# EAGLE schematic temp-sensor (EAGLE 9.6.2)
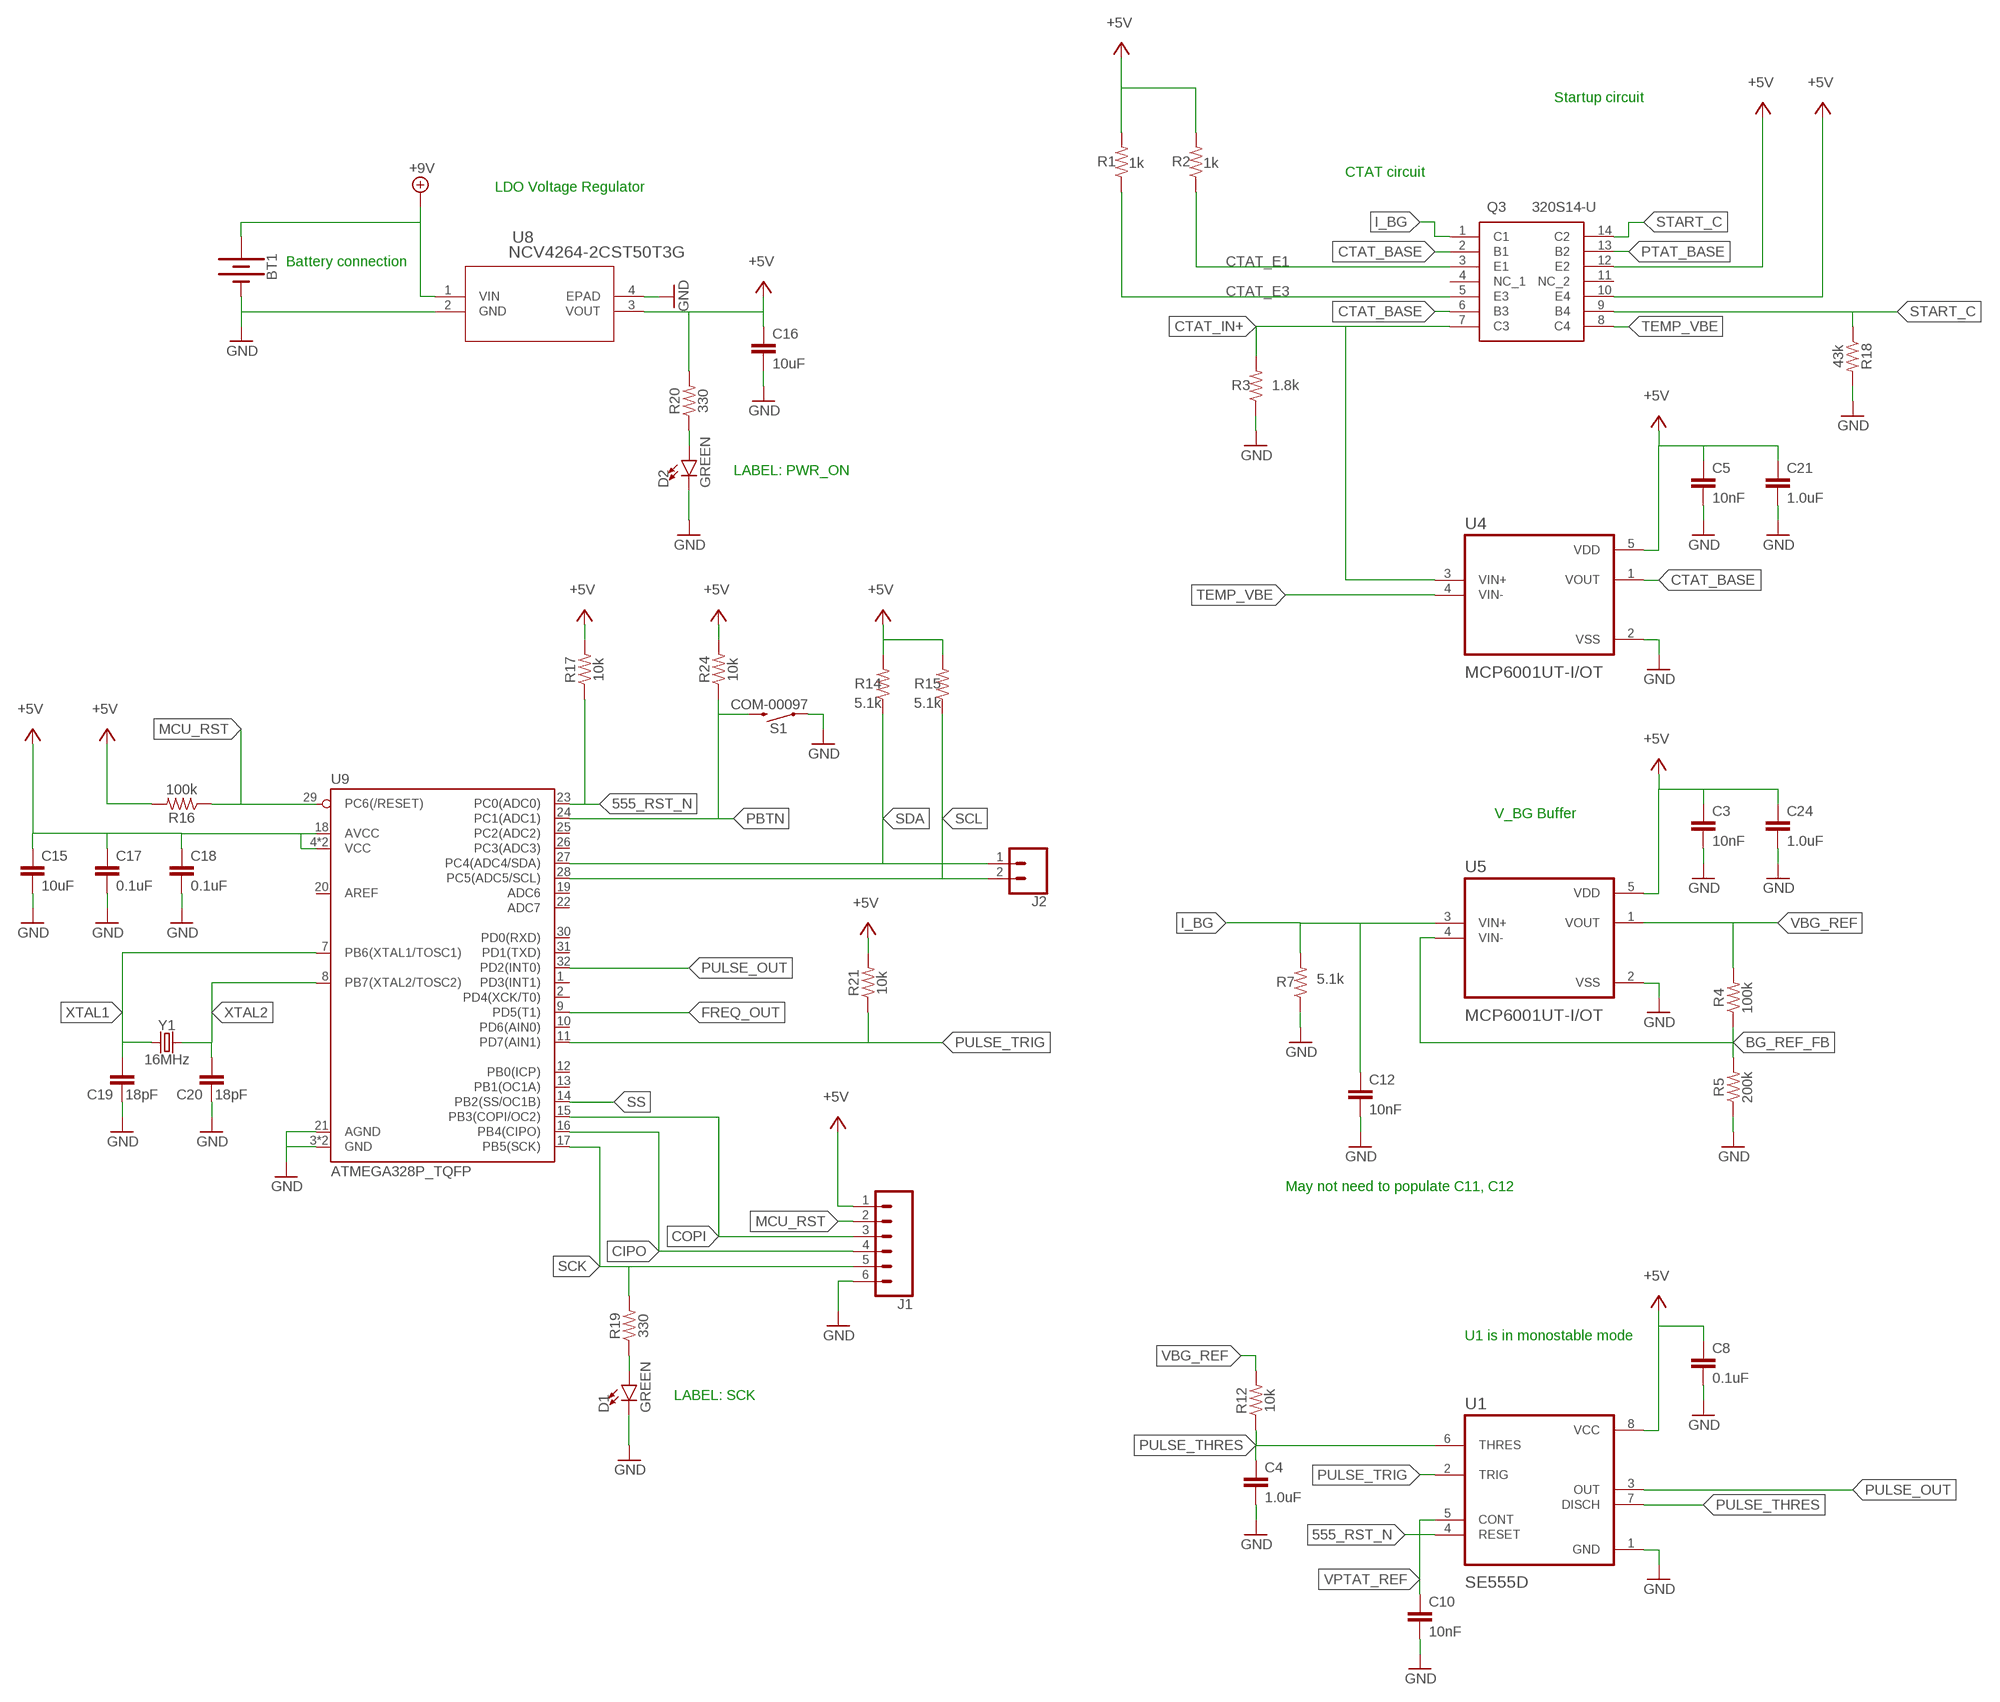
[diagram p0: schematic, sheet 1, part 1 of 2]
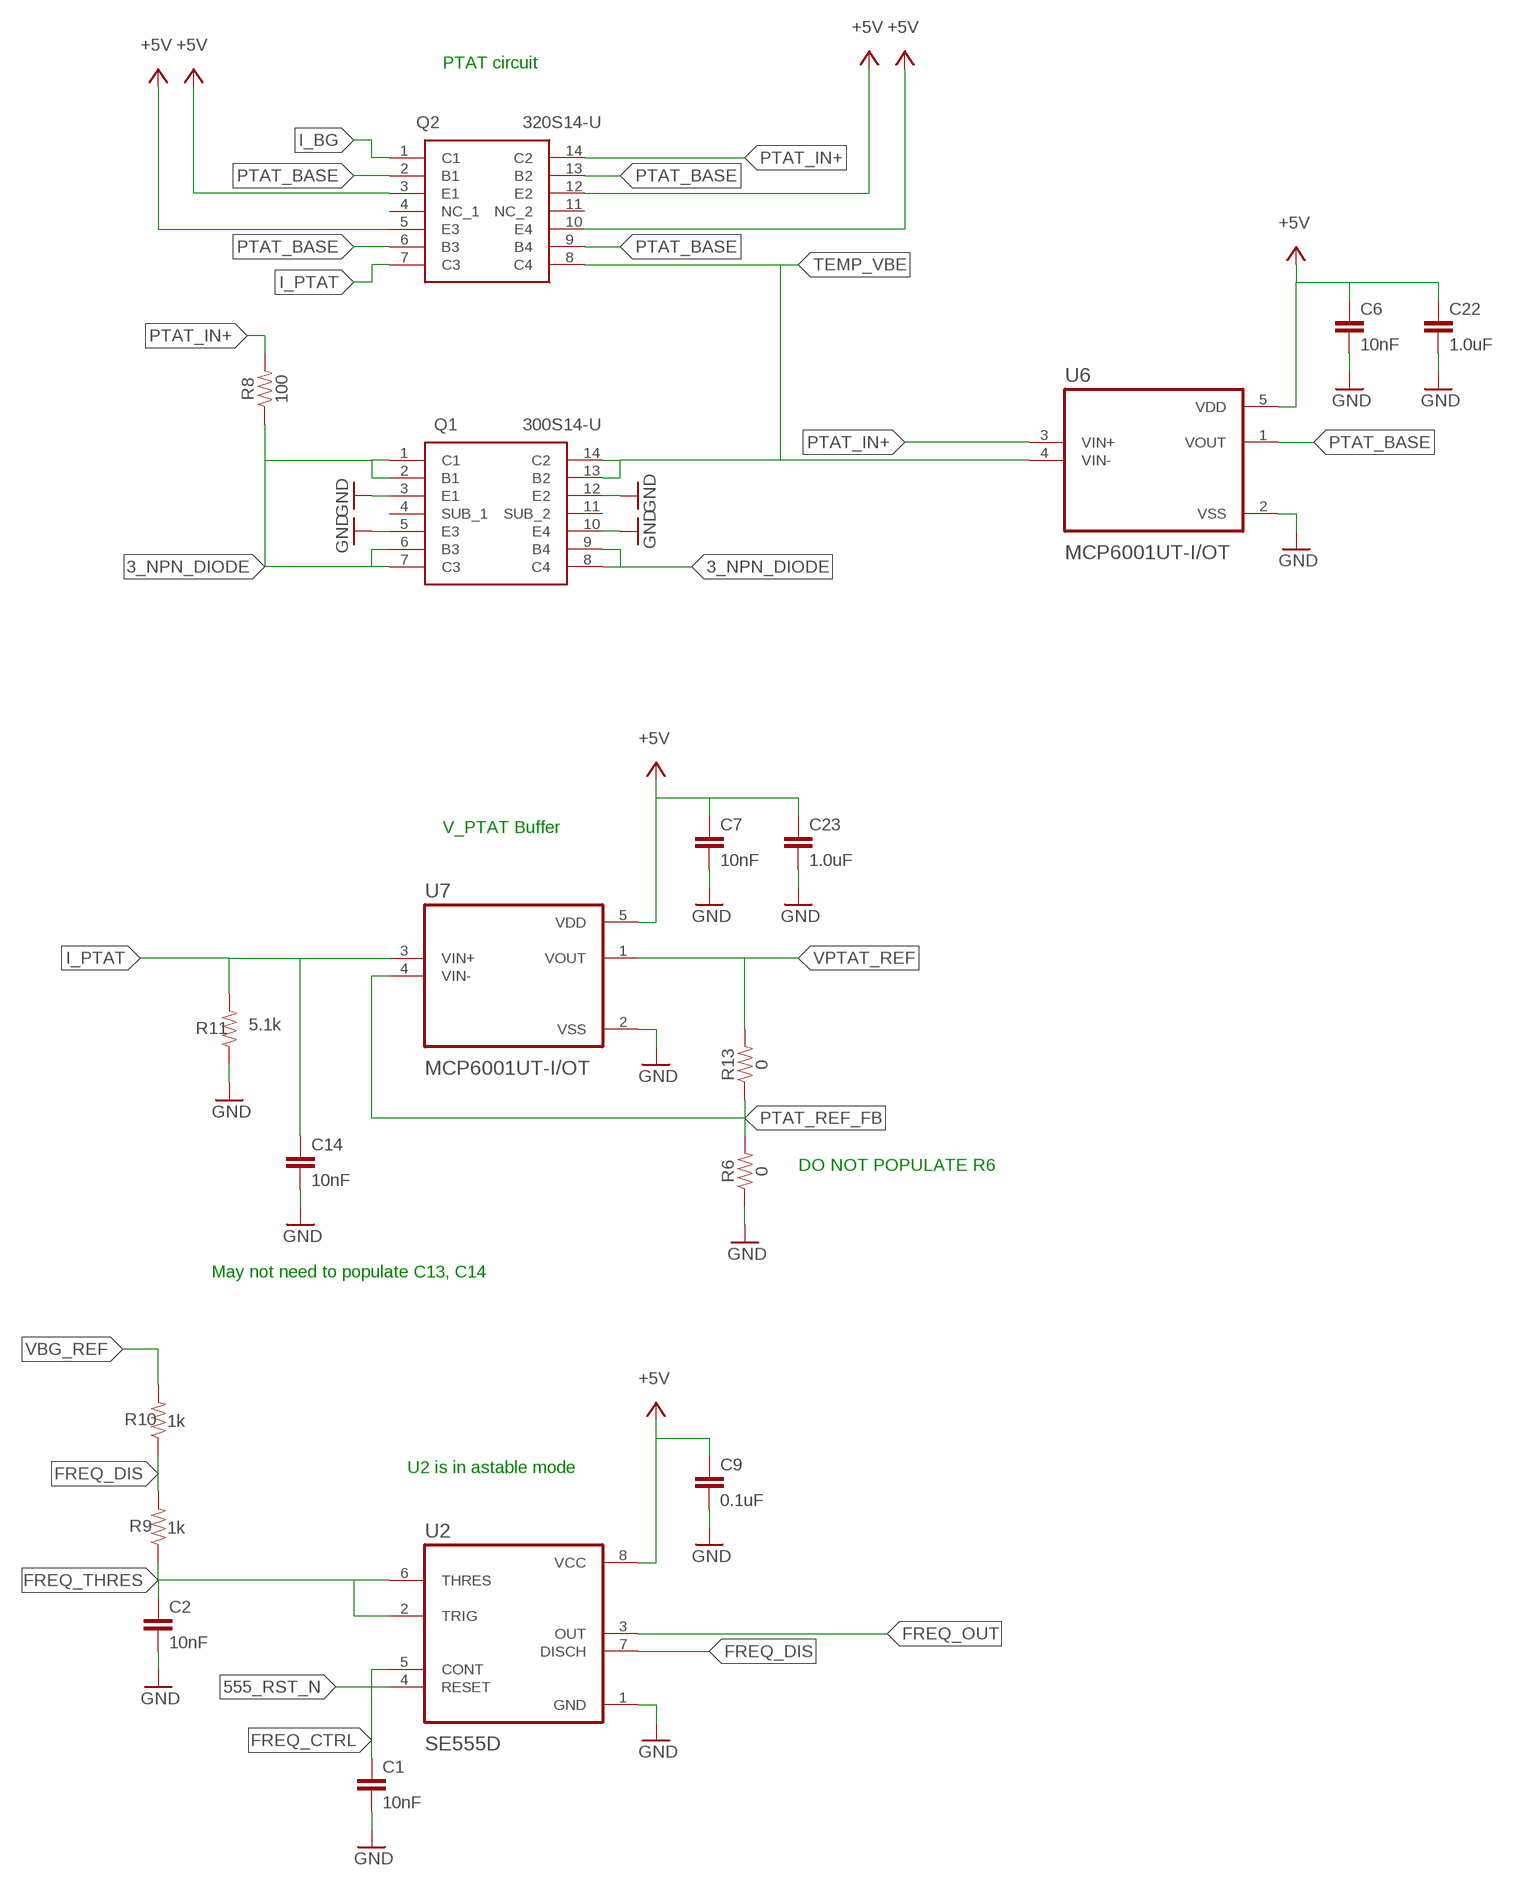
[diagram p1: schematic, sheet 1, part 2 of 2]

## Parts
BT1  BATTERY-9V  [BATTCON_9V]
C1  10nF  10NF-0603-50V-10%  [0603]
C2  10nF  10NF-0603-50V-10%  [0603]
C3  10nF  10NF-0603-50V-10%  [0603]
C4  1.0uF  1.0UF-0603-16V-10%-X7R  [0603]
C5  10nF  10NF-0603-50V-10%  [0603]
C6  10nF  10NF-0603-50V-10%  [0603]
C7  10nF  10NF-0603-50V-10%  [0603]
C8  0.1uF  0.1UF-0603-25V-10%-X7R-WE  [0603]
C9  0.1uF  0.1UF-0603-25V-10%-X7R-WE  [0603]
C10  10nF  10NF-0603-50V-10%  [0603]
C12  10nF  10NF-0603-50V-10%  [0603]
C14  10nF  10NF-0603-50V-10%  [0603]
C15  10uF  10UF-0805-25V-10%  [0805]
C16  10uF  10UF-0805-25V-10%  [0805]
C17  0.1uF  0.1UF-0603-25V-10%-X7R-WE  [0603]
C18  0.1uF  0.1UF-0603-25V-10%-X7R-WE  [0603]
C19  18pF  18PF-0603-50V-5%  [0603]
C20  18pF  18PF-0603-50V-5%  [0603]
C21  1.0uF  1.0UF-0603-16V-10%-X7R  [0603]
C22  1.0uF  1.0UF-0603-16V-10%-X7R  [0603]
C23  1.0uF  1.0UF-0603-16V-10%-X7R  [0603]
C24  1.0uF  1.0UF-0603-16V-10%-X7R  [0603]
D1  GREEN  LED-GREEN1206  [LED-1206]
D2  GREEN  LED-GREEN1206  [LED-1206]
J1  CONN_06SILK_FEMALE_PTH  [1X06]
J2  CONN_02  [1X02]
Q1  300S14-U  [SOIC127P602X175-14N]
Q2  320S14-U  [SOIC127P602X175-14N]
Q3  320S14-U  [SOIC127P602X175-14N]
R1  1k  1KOHM-0603-1/10W-1%  [0603]
R2  1k  1KOHM-0603-1/10W-1%  [0603]
R3  1.8k  1.8KOHM-0603-1/10W-1%  [0603]
R4  100k  100KOHM-0603-1/10W-1%  [0603]
R5  200k  200KOHM-0603-1/10W-1%  [0603]
R6  0  0OHM-0603-1/10W  [0603]
R7  5.1k  5.1KOHM5.1KOHM-0603-1/10W-1%  [0603]
R8  100  100OHM-0603-1/10W-1%  [0603]
R9  1k  1KOHM-0603-1/10W-1%  [0603]
R10  1k  1KOHM-0603-1/10W-1%  [0603]
R11  5.1k  5.1KOHM5.1KOHM-0603-1/10W-1%  [0603]
R12  10k  10KOHM-0603-1/10W-1%  [0603]
R13  0  0OHM-0603-1/10W  [0603]
R14  5.1k  5.1KOHM5.1KOHM-0603-1/10W-1%  [0603]
R15  5.1k  5.1KOHM5.1KOHM-0603-1/10W-1%  [0603]
R16  100k  100KOHM-0603-1/10W-1%  [0603]
R17  10k  10KOHM-0603-1/10W-1%  [0603]
R18  43k  43KOHM-0603-1/10W-1%  [0603]
R19  330  330OHM-0603-1/10W-1%  [0603]
R20  330  330OHM-0603-1/10W-1%  [0603]
R21  10k  10KOHM-0603-1/10W-1%  [0603]
R24  10k  10KOHM-0603-1/10W-1%  [0603]
S1  MOMENTARY-SWITCH-SPST-PTH-6.0MM  [TACTILE_SWITCH_PTH_6.0MM]
U1  SE555D  [SOIC127P599X175-8N]
U2  SE555D  [SOIC127P599X175-8N]
U4  MCP6001UT-I/OT  [SOT95P270X145-5N]
U5  MCP6001UT-I/OT  [SOT95P270X145-5N]
U6  MCP6001UT-I/OT  [SOT95P270X145-5N]
U7  MCP6001UT-I/OT  [SOT95P270X145-5N]
U8  NCV4264-2CST50T3G  [SOT-223_ONS]
U9  ATMEGA328P_TQFP  [TQFP32-08]
Y1  16MHz  CRYSTAL-16MHZSMD-5X3.2  [CRYSTAL-SMD-5X3.2-4PAD]

## Nets
3_NPN_DIODE: Q1.1(C1) Q1.2(B1) Q1.6(B3) Q1.7(C3) Q1.8(C4) Q1.9(B4) R8.1
555_RST_N: R17.1 U1.4(RESET) U2.4(RESET) U9.23(PC0(ADC0))
+5V: C3.1 C5.1 C6.1 C7.1 C8.1 C9.1 C15.1 C16.1 C18.1 C21.1 C22.1 C23.1 C24.1 J1.1 Q2.3(E1) Q2.5(E3) Q2.10(E4) Q2.12(E2) Q3.10(E4) Q3.12(E2) R1.2 R2.2 R14.2 R15.2 R16.2 R17.2 R20.2 R21.2 R24.2 U1.8(VCC) U2.8(VCC) U4.5(VDD) U5.5(VDD) U6.5(VDD) U7.5(VDD) U8.3(VOUT) U9.4(VCC) U9.6(VCC) U9.18(AVCC)
+9V: BT1.+ U8.1(VIN)
BG_REF_FB: R4.1 R5.2 U5.4(VIN-)
CIPO: J1.4 U9.16(PB4(CIPO))
COPI: J1.3 U9.15(PB3(COPI/OC2))
CTAT_BASE: Q3.2(B1) Q3.6(B3) U4.1(VOUT)
CTAT_E1: Q3.3(E1) R2.1
CTAT_E3: Q3.5(E3) R1.1
CTAT_IN+: Q3.7(C3) R3.2 U4.3(VIN+)
FREQ_CTRL: C1.1 U2.5(CONT)
FREQ_DIS: R9.2 R10.1 U2.7(DISCH)
FREQ_OUT: U2.3(OUT) U9.9(PD5(T1))
FREQ_THRES: C2.1 R9.1 U2.2(TRIG) U2.6(THRES)
GND: BT1.- C1.2 C2.2 C3.2 C4.2 C5.2 C6.2 C7.2 C8.2 C9.2 C10.2 C12.2 C14.2 C15.2 C16.2 C17.2 C18.2 C19.1 C20.1 C21.2 C22.2 C23.2 C24.2 D1.C D2.C J1.6 Q1.3(E1) Q1.5(E3) Q1.10(E4) Q1.12(E2) R3.1 R5.1 R6.1 R7.1 R11.1 R18.2 S1.1 U1.1(GND) U2.1(GND) U4.2(VSS) U5.2(VSS) U6.2(VSS) U7.2(VSS) U8.2(GND) U8.4(EPAD) U9.3(GND) U9.5(GND) U9.21(AGND)
I_BG: C12.1 Q2.1(C1) Q3.1(C1) R7.2 U5.3(VIN+)
I_PTAT: C14.1 Q2.7(C3) R11.2 U7.3(VIN+)
MCU_RST: J1.2 R16.1 U9.29(PC6(/RESET))
N$1: C17.1
N$2: D1.A R19.1
N$3: D2.A R20.1
PBTN: R24.1 S1.3 U9.24(PC1(ADC1))
PTAT_BASE: Q2.2(B1) Q2.6(B3) Q2.9(B4) Q2.13(B2) Q3.13(B2) U6.1(VOUT)
PTAT_IN+: Q2.14(C2) R8.2 U6.3(VIN+)
PTAT_REF_FB: R6.2 R13.1 U7.4(VIN-)
PULSE_OUT: U1.3(OUT) U9.32(PD2(INT0))
PULSE_THRES: C4.1 R12.1 U1.6(THRES) U1.7(DISCH)
PULSE_TRIG: R21.1 U1.2(TRIG) U9.11(PD7(AIN1))
SCK: J1.5 R19.2 U9.17(PB5(SCK))
SCL: J2.2 R15.1 U9.28(PC5(ADC5/SCL))
SDA: J2.1 R14.1 U9.27(PC4(ADC4/SDA))
SS: U9.14(PB2(SS/OC1B))
START_C: Q3.9(B4) Q3.14(C2) R18.1
TEMP_VBE: Q1.13(B2) Q1.14(C2) Q2.8(C4) Q3.8(C4) U4.4(VIN-) U6.4(VIN-)
VBG_REF: R4.2 R10.2 R12.2 U5.1(VOUT)
VPTAT_REF: C10.1 R13.2 U1.5(CONT) U7.1(VOUT)
XTAL1: C19.2 U9.7(PB6(XTAL1/TOSC1)) Y1.1
XTAL2: C20.2 U9.8(PB7(XTAL2/TOSC2)) Y1.3
Unconnected: Q1.4(SUB_1) Q1.11(SUB_2) Q2.4(NC_1) Q2.11(NC_2) Q3.4(NC_1) Q3.11(NC_2) U9.1(PD3(INT1)) U9.2(PD4(XCK/T0)) U9.10(PD6(AIN0)) U9.12(PB0(ICP)) U9.13(PB1(OC1A)) U9.19(ADC6) U9.20(AREF) U9.22(ADC7) U9.25(PC2(ADC2)) U9.26(PC3(ADC3)) U9.30(PD0(RXD)) U9.31(PD1(TXD))

## Notes on the sheet
- Startup circuit
- CTAT circuit | PTAT circuit
- LDO Voltage Regulator
- Battery connection
- LABEL: PWR_ON
- V_BG Buffer | V_PTAT Buffer
- DO NOT POPULATE R6
- May not need to populate C11, C12 | May not need to populate C13, C14
- U1 is in monostable mode
- U2 is in astable mode
- LABEL: SCK

## Library data of the parts
BT1 = SparkFun-Batteries:BATTERY: Battery - Single Cell A variety of battery chemistries, sizes, and footprints. Device List: 20MM_PTH - Coin Cell Battery Holder - 20mm (PTH) <https://www.sparkfun.com/products/783> 20MM_PTH_KIT- Coin Cell battery Holder - 20 mm (PTH) <http://www.sparkfun.com/products/783>kit version with special mask 6.8MM_PTH - Coin Cell Battery Holder - 6.8MM(SMD) <https://www.digikey.com/product-detail/en/seiko-instruments/MS621FE-FL11E/728-1057-ND/1889208?WT.srch=1&gclid=CNOQ5a6LzdQCFZS2wAodXCkE0g> 12MM_SMD - Coin Cell Battery Holder - 12mm (SMD) <https://www.sparkfun.com/products/10592> 12MM_PTH - Coin Cell Battery Holder - 12mm (PTH) <https://www.sparkfun.com/products/7948> 20MM_SMD - 20mm Coin Cell Battery Holder (SMD) (2 legs) Used on the Big Time Watch Kit <https://www.sparkfun.com/products/11734> 20MM_SMD_4LEGS - Coin Cell Battery Holder - 20mm (SMD) <https://www.sparkfun.com/products/11892> 20MM_SMD_4LEGS_OVERPASTE - Coin Cell Battery Holder - 20mm (SMD) <https://www.sparkfun.com/products/11892> (Over-paste on the legs) 24.5MM_PTH - Coin Cell Battery Holder - 24.5mm (PTH) <https://www.sparkfun.com/products/8863> 9V - 9V Battery Holder - PC Mount Used on the SparkFun SparkPunk Sound Kit <https://www.sparkfun.com/products/11177> and SparkFun SparkPunk Sequencer Kit <https://www.sparkfun.com/products/12707> 18650 - Battery Holder - 18650 (PTH) <https://www.sparkfun.com/products/13113> AA - Battery Holder - 1xAA (PTH) <https://www.sparkfun.com/products/7949> AAA - Battery Holder - 1xAAA (PTH) <https://www.sparkfun.com/products/12718> AA_KIT - Battery Holder - 1xAA (PTH) <https://www.sparkfun.com/products/7949> Special kit package - pads only have exposed copper on one side of the board. AAA_KIT - Battery Holder - 1xAAA (PTH) <https://www.sparkfun.com/products/12718> Special kit package - pads only have exposed copper on one side of the board.; PROD_ID: BATT-10855
C1-C3 C5-C7 C10 C12 C14 = SparkFun-Capacitors:10NF: 0.01uF/10nF/10,000pF ceramic capacitors A capacitor is a passive two-terminal electrical component used to store electrical energy temporarily in an electric field. CAP-09321; PROD_ID: CAP-00867
C4 C21-C24 = SparkFun-Capacitors:1.0UF: 1µF ceramic capacitors A capacitor is a passive two-terminal electrical component used to store electrical energy temporarily in an electric field.; PROD_ID: CAP-13930
C8 C9 C17 C18 = SparkFun-Capacitors:0.1UF: 0.1µF ceramic capacitors A capacitor is a passive two-terminal electrical component used to store electrical energy temporarily in an electric field.; PROD_ID: CAP-16503
C15 C16 = SparkFun-Capacitors:10UF: 10.0µF ceramic capacitors A capacitor is a passive two-terminal electrical component used to store electrical energy temporarily in an electric field.; PROD_ID: CAP-14259
C19 C20 = SparkFun-Capacitors:18PF: 18pF ceramic capacitors A capacitor is a passive two-terminal electrical component used to store electrical energy temporarily in an electric field.; PROD_ID: CAP-08267
D1 D2 = SparkFun-LED:LED-GREEN: Green SMD LED Used in manufacturing of various products at SparkFun Packages: 0603 - SMD 0603 package [Product Link] <http://www.futureelectronics.com/en/technologies/semiconductors/optoelectronics/leds/Pages/9894312-LTST-C190GKT.aspx?CrossPart=HSMG-C190&IM=0> LilyPad 1206 - SMD1206 LilyPad package [Product Link] <http://www.futureelectronics.com/en/Technologies/Product.aspx?ProductID=IN150NGHARVATEKCORPORATION2049943&IM=0> 1206 - SMD1206 package [Product Link] <http://www.futureelectronics.com/en/technologies/semiconductors/optoelectronics/leds/Pages/8315665-LTST-C150KGKT.aspx?IM=0> 1206 Bottom Mount -SMD 1206 Bottom Mount [Product Link] <http://www.digikey.com/product-detail/en/lite-on-inc/LTST-C230KGKT/160-1456-1-ND/386854> SparkFun Products: Pro Mini 328 -5V <https://www.sparkfun.com/products/821> RedBoard <https://www.sparkfun.com/products/12757> MP3 Trigger <https://www.sparkfun.com/products/13720> Makey Makey <https://www.sparkfun.com/products/11076>; PROD_ID: DIO-00862
J1 = SparkFun-Connectors:CONN_06: Multi connection point. Often used as Generic Header-pin footprint for 0.1 inch spaced/style header connections On any of the 0.1 inch spaced packages, you can populate with these: Break Away Headers - Straight <https://www.sparkfun.com/products/116> (PRT-00116) Break Away Male Headers - Right Angle <https://www.sparkfun.com/products/553> (PRT-00553) Female Headers <https://www.sparkfun.com/products/115> (PRT-00115) Break Away Headers - Machine Pin <https://www.sparkfun.com/products/117> (PRT-00117) Break Away Female Headers - Swiss Machine Pin <https://www.sparkfun.com/products/743> (PRT-00743) Arduino Stackable Header - 6 Pin <https://www.sparkfun.com/products/9280> (PRT-09280) Screw Terminals 2.54mm Pitch (6-Pin) <https://www.sparkfun.com/products/16499> (PRT-16499) For SCREWTERMINALS and SPRING TERMINALS visit here: Screw Terimnals on SparkFun.com <https://www.sparkfun.com/search/results?term=Screw+Terminals> (5mm/3.5mm/2.54mm spacing) This device is also useful as a general connection point to wire up your design to another part of your project. Our various solder wires solder well into these plated through hole pads. Hook-Up Wire - Assortment (Stranded, 22 AWG) <https://www.sparkfun.com/products/11375> (PRT-11375) Hook-Up Wire - Assortment (Solid Core, 22 AWG) <https://www.sparkfun.com/products/11367> (PRT-11367) View the entire wire category on our website here <https://www.sparkfun.com/categories/141>; PROD_ID: CONN-08437
J2 = SparkFun-Connectors:CONN_02: Multi connection point. Often used as Generic Header-pin footprint for 0.1 inch spaced/style header connections On any of the 0.1 inch spaced packages, you can populate with these: Break Away Headers - Straight <https://www.sparkfun.com/products/116> (PRT-00116) Break Away Male Headers - Right Angle <https://www.sparkfun.com/products/553> (PRT-00553) Female Headers <https://www.sparkfun.com/products/115> (PRT-00115) Break Away Headers - Machine Pin <https://www.sparkfun.com/products/117> (PRT-00117) Break Away Female Headers - Swiss Machine Pin <https://www.sparkfun.com/products/743> (PRT-00743) For SCREWTERMINALS and SPRING TERMINALS visit here: Screw Terimnals on SparkFun.com <https://www.sparkfun.com/search/results?term=Screw+Terminals> (5mm/3.5mm/2.54mm spacing) This device is also useful as a general connection point to wire up your design to another part of your project. Our various solder wires solder well into these plated through hole pads. Hook-Up Wire - Assortment (Stranded, 22 AWG) <https://www.sparkfun.com/products/11375> (PRT-11375) Hook-Up Wire - Assortment (Solid Core, 22 AWG) <https://www.sparkfun.com/products/11367> (PRT-11367) View the entire wire category on our website here <https://www.sparkfun.com/categories/141> Special notes: Molex polarized connector foot print use with: PRT-08233 with associated crimp pins and housings. 2.54_SCREWTERM for use with PRT-10571. 3.5mm Screw Terminal footprints for PRT-08084 5mm Screw Terminal footprints for use with PRT-08432
Q1 = 300S14-U:300S14-U: Bipolar Transistors - BJT 4 NPN Matched Trans. Array SO-14 Source: Datasheet; DESCRIPTION: Bipolar Transistors - BJT 4 NPN Matched Trans. Array SO-14; HEIGHT: 1.75mm; MANUFACTURER_NAME: THAT CORPORATION; MANUFACTURER_PART_NUMBER: 300S14-U; MOUSER_PART_NUMBER: 887-300S14-U; MOUSER_PRICE-STOCK: https://www.mouser.co.uk/ProductDetail/THAT/300S14-U?qs=wN%2Fcur4AVWdHgHcGlLafqA%3D%3D
Q2 Q3 = 320S14-U:320S14-U: Bipolar Transistors - BJT 4 PNP Matched Trans. Array SO-14 Source: Datasheet <http://www.thatcorp.com/datashts/THAT_300-Series_Datasheet.pdf>; DESCRIPTION: Bipolar Transistors - BJT 4 PNP Matched Trans. Array SO-14; HEIGHT: 1.75mm; MANUFACTURER_NAME: THAT CORPORATION; MANUFACTURER_PART_NUMBER: 320S14-U; MOUSER_PART_NUMBER: 887-320S14-U; MOUSER_PRICE-STOCK: https://www.mouser.co.uk/ProductDetail/THAT/320S14-U?qs=9Udfh7QmL4u%252BQY2LzA4HXA%3D%3D
R1 R2 R9 R10 = SparkFun-Resistors:1KOHM: 1kΩ resistor A resistor is a passive two-terminal electrical component that implements electrical resistance as a circuit element. Resistors act to reduce current flow, and, at the same time, act to lower voltage levels within circuits. - Wikipedia; PROD_ID: RES-07856
R3 = SparkFun-Resistors:1.8KOHM: 1.8kΩ resistor A resistor is a passive two-terminal electrical component that implements electrical resistance as a circuit element. Resistors act to reduce current flow, and, at the same time, act to lower voltage levels within circuits. - Wikipedia; PROD_ID: RES-09119
R4 R16 = SparkFun-Resistors:100KOHM: 100kΩ resistor A resistor is a passive two-terminal electrical component that implements electrical resistance as a circuit element. Resistors act to reduce current flow, and, at the same time, act to lower voltage levels within circuits. - Wikipedia; PROD_ID: RES-07828
R5 = SparkFun-Resistors:200KOHM: 200kΩ resistor A resistor is a passive two-terminal electrical component that implements electrical resistance as a circuit element. Resistors act to reduce current flow, and, at the same time, act to lower voltage levels within circuits. - Wikipedia; PROD_ID: RES-09385
R6 R13 = SparkFun-Resistors:0OHM: 0Ω resistor A resistor is a passive two-terminal electrical component that implements electrical resistance as a circuit element. Resistors act to reduce current flow, and, at the same time, act to lower voltage levels within circuits. - Wikipedia; PROD_ID: RES-08609
R7 R11 R14 R15 = SparkFun-Resistors:5.1KOHM; PROD_ID: RES-12083
R8 = SparkFun-Resistors:100OHM: 100Ω resistor A resistor is a passive two-terminal electrical component that implements electrical resistance as a circuit element. Resistors act to reduce current flow, and, at the same time, act to lower voltage levels within circuits. - Wikipedia; PROD_ID: RES-07863
R12 R17 R21 R24 = SparkFun-Resistors:10KOHM: 10kΩ resistor A resistor is a passive two-terminal electrical component that implements electrical resistance as a circuit element. Resistors act to reduce current flow, and, at the same time, act to lower voltage levels within circuits. - Wikipedia; PROD_ID: RES-00824
R18 = SparkFun-Resistors:43KOHM: 43kΩ resistor A resistor is a passive two-terminal electrical component that implements electrical resistance as a circuit element. Resistors act to reduce current flow, and, at the same time, act to lower voltage levels within circuits. - Wikipedia; PROD_ID: RES-07858
R19 R20 = SparkFun-Resistors:330OHM: 330Ω resistor A resistor is a passive two-terminal electrical component that implements electrical resistance as a circuit element. Resistors act to reduce current flow, and, at the same time, act to lower voltage levels within circuits. - Wikipedia; PROD_ID: RES-00818
S1 = SparkFun-Switches:MOMENTARY-SWITCH-SPST: Momentary Switch (Pushbutton) - SPST Normally-open (NO) SPST momentary switches (buttons, pushbuttons). Variants PTH-12MM - 12mm square, through-hole Momentary Pushbutton Switch - 12mm Square <https://www.sparkfun.com/products/9190> (COM-09190) PTH-6.0MM, PTH-6.0MM-KIT - 6.0mm square, through-hole Mini Pushbutton Switch <https://www.sparkfun.com/products/97> (COM-00097) KIT package intended for soldering kit's - only one side of pads' copper is exposed. PTH-RIGHT-ANGLE-KIT - Right-angle, through-hole Right Angle Tactile Button <https://www.sparkfun.com/products/10791> - Used on SparkFun BigTime Watch Kit <https://www.sparkfun.com/products/11734> SMD-12MM - 12mm square, surface-mount Tactile Button - SMD (12mm) <https://www.sparkfun.com/products/12993> (COM-12993) Used on SparkFun PicoBoard <https://www.sparkfun.com/products/11888> SMD-4.5MM - 4.5mm Square Trackball Switch Used on SparkFun Blackberry Trackballer Breakout <https://www.sparkfun.com/products/13169> SMD-4.6MMX2.8MM - 4.60mm x 2.80mm, surface mount Used on SparkFun Pro Micro - RP2040 <https://www.sparkfun.com/products/17717> SMD-5.2MM, SMD-5.2-REDUNDANT - 5.2mm square, surface-mount Mini Pushbutton Switch - SMD <https://www.sparkfun.com/products/8720> (COM-08720) Used on Arduino Pro Mini <https://www.sparkfun.com/products/11114> REDUNDANT package connects both switch circuits together SMD-6.0X3.5MM - 6.0 x 3.5mm, surface mount Momentary Reset Switch SMD <https://www.sparkfun.com/products/8229> (COM-08229) SMD-6.2MM-TALL - 6.2mm square, surface mount Tactile Button - SMD (6mm) <https://www.sparkfun.com/products/12992> Used on SparkFun Digital Sandbox <https://www.sparkfun.com/products/12651> SMD-RIGHT-ANGLE - Right-angle, surface mount Used on SparkFun Block for Intel® Edison - Arduino <https://www.sparkfun.com/products/13036>; PROD_ID: SWCH-08441; SF_SKU: COM-00097
U1 U2 = SE555D:SE555D: None Check availability <https://pricing.snapeda.com/parts/SE555D/Texas%20Instruments/view-part?ref=eda>; AVAILABILITY: In Stock; CHECK_PRICES: https://www.snapeda.com/parts/SE555D/Texas+Instruments/view-part/?ref=eda; DESCRIPTION: Precision timer for -55 to 125C operation; MF: Texas Instruments; MP: SE555D; PACKAGE: SOIC-8 Texas Instruments; PRICE: None; PURCHASE-URL: https://www.snapeda.com/api/url_track_click_mouser/?unipart_id=4805641&manufacturer=Texas Instruments&part_name=SE555D&search_term=se555d; SNAPEDA_LINK: https://www.snapeda.com/parts/SE555D/Texas+Instruments/view-part/?ref=snap
U4-U7 = MCP6001UT-I_OT:MCP6001UT-I/OT
U8 = NCV4264-2CST50T3G:NCV4264-2CST50T3G; COPYRIGHT: Copyright (C) 2024 Ultra Librarian. All rights reserved.; MANUFACTURER_PART_NUMBER: NCV4264-2CST50T3G; MFR_NAME: onsemi
U9 = SparkFun-IC-Microcontroller:ATMEGA328P_TQFP: Popular 328P in QFP Storefront component: ATmega328 - TQFP <https://www.sparkfun.com/products/13448> (COM-13448) Datasheet <http://www.sparkfun.com/datasheets/Components/SMD/ATMega328.pdf> SparkFun Products SparkFun RedBoard - Programmed with Arduino <https://www.sparkfun.com/products/12757> (DEV-12757) Arduino Pro Mini 328 - 5V/16MHz <https://www.sparkfun.com/products/11113> (DEV-11113) Arduino Pro Mini 328 - 3.3V/8MHz <https://www.sparkfun.com/products/11114> (DEV-11114) SparkFun OpenLog <https://www.sparkfun.com/products/13712> (DEV-13712) SparkFun MicroView - OLED Arduino Module <https://www.sparkfun.com/products/12923> (DEV-12923) SparkFun Digital Sandbox <https://www.sparkfun.com/products/12651> (DEV-12651) SparkFun PicoBoard <https://www.sparkfun.com/products/11888> (WIG-11888) Arduino Fio <https://www.sparkfun.com/products/10116> (DEV-10116) LilyPad Arduino 328 Main Board <https://www.sparkfun.com/products/13342> (DEV-13342) SparkFun RedStick <https://www.sparkfun.com/products/13741> (DEV-13741) LilyPad MP3 <https://www.sparkfun.com/products/11013> (DEV-11013) LilyPad Arduino SimpleSnap <https://www.sparkfun.com/products/10941> (DEV-10941) SparkFun Stepoko <https://www.sparkfun.com/products/13899> (ROB-13899) SparkFun Geiger Counter <https://www.sparkfun.com/products/11345> (SEN-11345) SparkFun EL Sequencer <https://www.sparkfun.com/products/12781> (COM-12781) Arduino Pro 328 - 5V/16MHz <https://www.sparkfun.com/products/10915> (DEV-10915) CryptoCape <https://www.sparkfun.com/products/12773> (DEV-12773) SparkFun IR Thermometer Evaluation Board - MLX90614 <https://www.sparkfun.com/products/10740> (SEN-10740) SparkFun RedBot Mainboard <https://www.sparkfun.com/products/12097> (ROB-12097) Arduino Pro 328 - 3.3V/8MHz <https://www.sparkfun.com/products/10914> (DEV-10914) SparkFun Block for Intel® Edison - Arduino <https://www.sparkfun.com/products/13036> (DEV-13036) SparkFun Simon Says - Surface Mount Soldering Kit <https://www.sparkfun.com/products/10935> (KIT-10935) SparkFun 7-Segment Serial Display - Red <https://www.sparkfun.com/products/11441> (COM-11441) SparkFun 7-Segment Serial Display - White <https://www.sparkfun.com/products/11629> (COM-11629) SparkFun 7-Segment Serial Display - Yellow <https://www.sparkfun.com/products/11443> (COM-11443) SparkFun 7-Segment Serial Display - Kelly Green <https://www.sparkfun.com/products/11440> (COM-11440) SparkFun 7-Segment Serial Display - Blue <https://www.sparkfun.com/products/11442> (COM-11442) SparkFun OpenSegment Serial Display - 20mm (Blue) <https://www.sparkfun.com/products/11647> (COM-11647) SparkFun OpenSegment Serial Display - 20mm (Green) <https://www.sparkfun.com/products/11646> (COM-11646) SparkFun OpenSegment Serial Display - 20mm (White) <https://www.sparkfun.com/products/11648> (COM-11648) SparkFun OpenSegment Serial Display - 20mm (Red) <https://www.sparkfun.com/products/11644> (COM-11644) SparkFun OpenSegment Serial Display - 20mm (Yellow) <https://www.sparkfun.com/products/11645> (COM-11645) SparkFun OpenSegment Shield <https://www.sparkfun.com/products/13190> (DEV-13190); PROD_ID: IC-09069
Y1 = SparkFun-Clocks:CRYSTAL-16MHZ: 16MHz Crystal Digikey Example <http://www.digikey.com/product-search/en?keywords=535-9122-1-ND> Frequency: 16MHz Frequency Stability: ±50ppm Frequency Tolerance: ±20ppm Load Capacitance: 18pF SparkFun Products: Pro Micro -5V/16MHz <https://www.sparkfun.com/products/12640> SparkFun Serial Enabled LCD Kit <https://www.sparkfun.com/products/10097>; PROD_ID: XTAL-08218; SF_ID: COM-00094